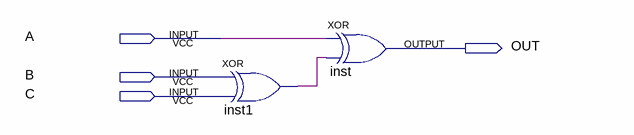
[diagram p0: schematic sheet]
// Quartus schematic xor3.bdf as structural Verilog: 2 symbols, 4 pins
module xor3 (
  input  A,
  input  B,
  input  C,
  output OUT
);

  wire inst1_out;

  xor inst1 (inst1_out, B, C);
  xor inst (OUT, A, inst1_out);
endmodule
